# Altium schematic sheet Sheet2_usb.SchDoc
size A
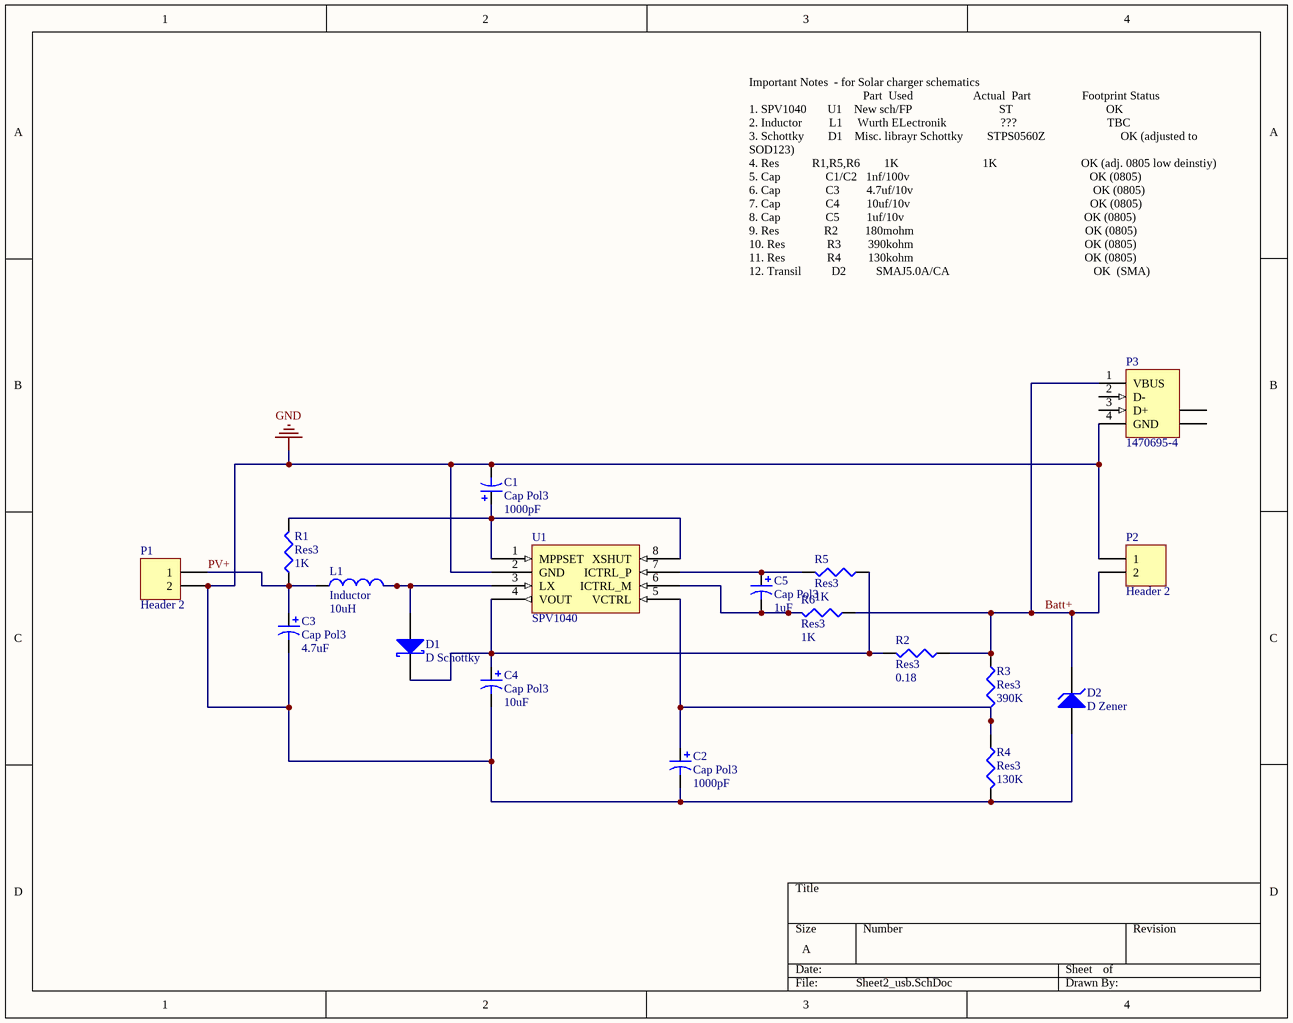
[diagram p0: Sheet2_usb.SchDoc]

## Parts
C1  Cap Pol3  value 1000pF  [2012[0805]]
C2  Cap Pol3  value 1000pF  [2012[0805]]
C3  Cap Pol3  value 4.7uF  [2012[0805]]
C4  Cap Pol3  value 10uF  [2012[0805]]
C5  Cap Pol3  value 1uF  [2012[0805]]
D1  D Schottky  [SOD123]
D2  D Zener  [DSO-C2/X1.8]
L1  Inductor  value 10uH  [INDP8181X30N]
P1  Header 2  [HDR1X2]
P2  Header 2  [HDR1X2]
P3  1470695-4  [1470695A]
R1  Res3  value 1K  [2012[0805]]
R2  Res3  value 0.18  [2012[0805]]
R3  Res3  value 390K  [2012[0805]]
R4  Res3  value 130K  [2012[0805]]
R5  Res3  value 1K  [2012[0805]]
R6  Res3  value 1K  [2012[0805]]
U1  SPV1040  [TSOP65P640-8AM]

## Nets
GND: C1.2 C2.2 C3.2 C4.2 D2.1(A) P1.2 P2.1 P3.4(GND) R4.2 U1.2(GND)
Batt+: D2.2(K) P2.2 P3.1(VBUS) R2.1 R3.1 R6.1
PV+: C3.1 L1.1 P1.1 R1.1
NetC1_1: C1.1 R1.2 U1.1(MPPSET) U1.8(XSHUT)
NetC2_1: C2.1 R3.2 R4.1 U1.5(VCTRL)
NetC4_1: C4.1 D1.2(K) R2.2 R5.1 U1.4(VOUT)
NetC5_1: C5.1 R5.2 U1.7(ICTRL_P)
NetC5_2: C5.2 R6.2 U1.6(ICTRL_M)
NetD1_1: D1.1(A) L1.2 U1.3(LX)

Not connected (* = marked no-connect by the designer): P3 2(D-) 3(D+) 5(SHLD) 6(SHLD)

## Notes on the sheet
- Important Notes  - for Solar charger schematics
  Part  Used                    Actual  Part                 Footprint Status
  1. SPV1040       U1    New sch/FP                             ST                               OK
  2. Inductor         L1     Wurth ELectronik                  ???                              TBC
  3. Schottky        D1    Misc. librayr Schottky        STPS0560Z                         OK (adjusted to SOD123)
  4. Res           R1,R5,R6        1K                            1K                            OK (adj. 0805 low deinstiy)
  5. Cap               C1/C2   1nf/100v                                                            OK (0805)
  6. Cap               C3         4.7uf/10v                                                            OK (0805)
  7. Cap               C4         10uf/10v                                                            OK (0805)
  8. Cap               C5         1uf/10v                                                            OK (0805)
  9. Res               R2         180mohm                                                         OK (0805)
  10. Res              R3         390kohm                                                         OK (0805)
  11. Res              R4         130kohm                                                         OK (0805)
  12. Transil          D2          SMAJ5.0A/CA                                                OK  (SMA)

## Library data of the parts
C1-C5 = Cap Pol3: Polarized Capacitor (Surface Mount); Published: 8-Jun-2000; LatestRevisionDate: 29-May-2009; LatestRevisionNote: IPC-7351 Footprint Added.; PackageReference: C0805; Publisher: Altium Limited; PackageDescription: Chip Capacitor
D1 = D Schottky: Schottky Diode; Published: 8-Jun-2000; LatestRevisionDate: 17-Jul-2002; LatestRevisionNote: Re-released for DXP Platform.; PackageReference: SMB; Publisher: Altium Limited; PackageDescription: DO-214-AA/SMB; 2 C-Bend Leads; Body 5.3 x 3.6 mm, inc. leads (LxW); Code_JEDEC: DO-214-AA
D2 = D Zener: Zener Diode; Published: 8-Jun-2000; LatestRevisionDate: 17-Jul-2002; LatestRevisionNote: Re-released for DXP Platform.; PackageReference: DIODE-0.7; Publisher: Altium Limited; PackageDescription: Diode, Thru-Hole; 2 Leads; 0.7 in Pin Spacing
L1 = Inductor: Code_IEC: 1005; Published: 8-Jun-2000; LatestRevisionDate: 29-May-2009; LatestRevisionNote: IPC-7351 Footprint Added.; PackageReference: 0402-A; Publisher: Altium Limited; PackageDescription: Chip Inductor; Code_JEITA: 0402
P1 P2 = Header 2: Header, 2-Pin; LatestRevisionDate: 17-Jul-2002; LatestRevisionNote: Re-released for DXP Platform.; Publisher: Altium Limited
P3 = 1470695-4: USB 1.1, Right Angle, SMT, A Type, Plug, 4 Position, Black; ContactMaterial: Brass; ContactPlating: Gold (30) over Nickel (50); PCB_Layout: Complies with manufacturer's recommendation.; DrillSize: Corresponds to nominal value.; PanelGround: Without; Published: 15-Jul-2004; DatasheetDocument: 21-Jan-2003; PackageDocument: 21-Jan-2003; PackageReference: 1470695A; Publisher: Altium Limited; HousingMaterial: Thermoplastic; ComponentLink1Description: Manufacturer Link; ComponentLink1URL: http://www.tycoelectronics.com/; ComponentLink2Description: Packaging Specification; ComponentLink2URL: http://ecommas.tycoelectronics.com/commerce/DocumentDelivery/DDEController?Action=showdoc&DocId=Customer+Drawing%7F1470695%7FO%7Fpdf%7FEnglish%7FC_1470695_O.pdf
R1-R6 = Res3: Resistor; Published: 8-Jun-2000; LatestRevisionDate: 29-May-2009; LatestRevisionNote: IPC-7351 Footprint Added.; PackageReference: J1-0603; Publisher: Altium Limited; PackageDescription: Chip Resistor
U1 = Component_1: MPPT DC DC switcher